# Altium project Stallmaster3000.PrjPcb
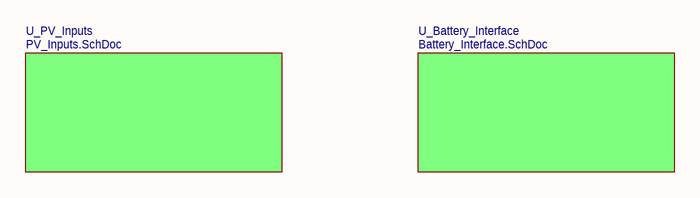
[diagram p0: Overview.SchDoc]
3 sheets, 12 parts. Net scope: global (net labels, ports and power ports of the same name join across sheets).
Sheets:
  Overview.SchDoc
    U_PV_Inputs = PV_Inputs.SchDoc
    U_Battery_Interface = Battery_Interface.SchDoc

## Sheet Overview.SchDoc
size A4; SheetNumber: 1; SheetTotal: 3

### Sub-sheets
U_Battery_Interface = Battery_Interface.SchDoc: no entries
U_PV_Inputs = PV_Inputs.SchDoc: no entries

## Sheet PV_Inputs.SchDoc
size A4; SheetNumber: 2; SheetTotal: 3
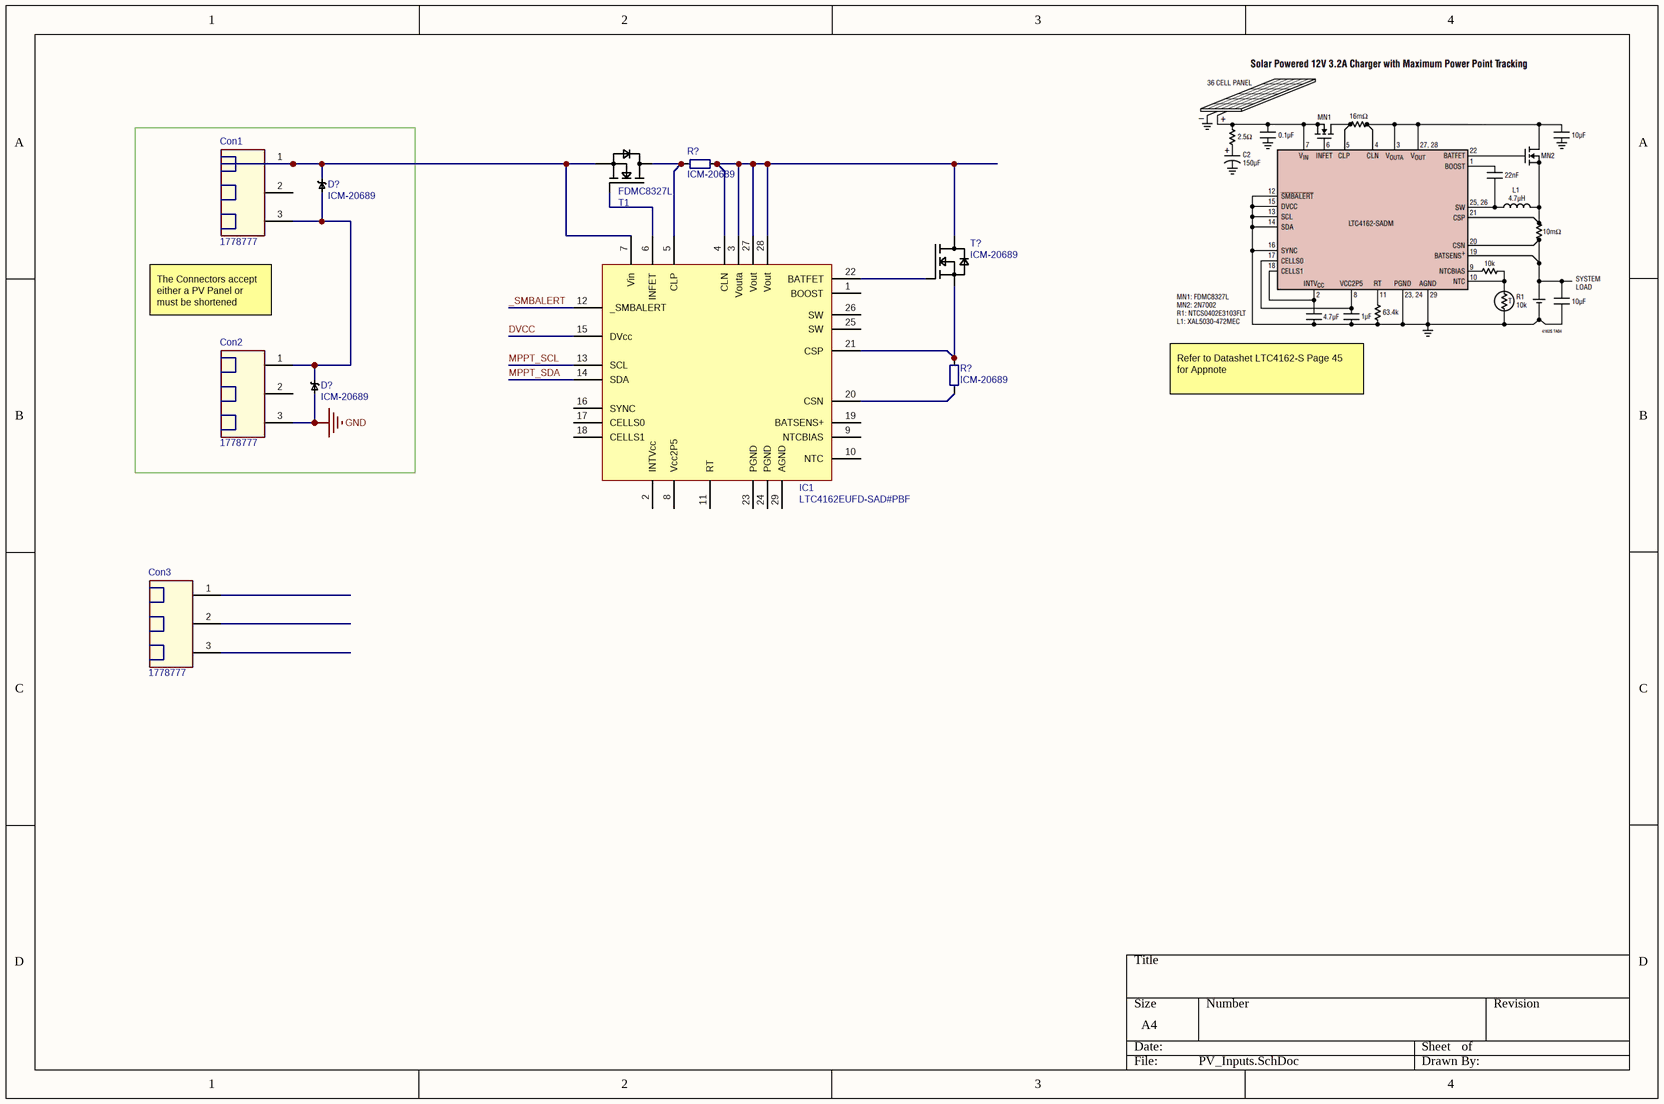
[diagram p1: PV_Inputs.SchDoc]

### Parts
(Parts that share a designator on the sheet are numbered #1, #2 ... from top to bottom, then left to right.)
Con1  1778777  [term_block_1row_3pin_phoenix_smd_2.5mm_90deg_1778777]
Con2  1778777  [term_block_1row_3pin_phoenix_smd_2.5mm_90deg_1778777]
Con3  1778777  [term_block_1row_3pin_phoenix_smd_2.5mm_90deg_1778777]
D?#1  ICM-20689  [DIOM6959X25N]
D?#2  ICM-20689  [DIOM6959X25N]
IC1  LTC4162EUFD-SAD#PBF  [TSQFP50P450X550X80_HS-29N]
R?#1  ICM-20689  [RESC6432X09N]
R?#2  ICM-20689  [RESC1006X04N]
T1  FDMC8327L  [FDMC8327L-D]
T?  ICM-20689  [ic-tdk-qfn-24]

### Nets
GND: Con2.3 D?#2.2(A)
_SMBALERT: IC1.12(_SMBALERT)
DVCC: IC1.15(DVcc)
MPPT_SCL: IC1.13(SCL)
MPPT_SDA: IC1.14(SDA)
NetCon1_1: Con1.1 D?#1.1(K) IC1.7(Vin) T1.1(S)
NetCon1_3: Con1.3 Con2.1 D?#1.2(A) D?#2.1(K)
NetIC1_3: IC1.3(Vouta) IC1.4(CLN) IC1.27(Vout) IC1.28(Vout) R?#1.2 T?.3(D)
NetIC1_5: IC1.5(CLP) R?#1.1 T1.5(D)
NetIC1_6: IC1.6(INFET) T1.4(G)
NetIC1_20: IC1.20(CSN) R?#2.1
NetIC1_21: IC1.21(CSP) R?#2.2 T?.2(S)
NetIC1_22: IC1.22(BATFET) T?.1(G)

Not connected (* = marked no-connect by the designer): Con1 2; Con2 2; Con3 1 2 3; IC1 1(BOOST) 2(INTVcc) 8(Vcc2P5) 9(NTCBIAS) 10(NTC) 11(RT) 16(SYNC) 17(CELLS0) 18(CELLS1) 19(BATSENS+) 23(PGND) 24(PGND) 25(SW) 26(SW) 29(AGND); T1 2(S) 3(S) 6(D) 7(D) 8(D)

### Notes on the sheet
- (near R?#1) Kelvin Connection for Current Sensing
- The Connectors accept either a PV Panel or must be shortened
- Refer to Datashet LTC4162-S Page 45 for Appnote

### Library data of the parts
Con1-Con3 = 1778777: TERM BLOCK HDR 3POS 90DEG 2.5MM; Manufacturer: Phoenix Contact; Manufacturer Standard Lead Time: 4 Weeks; ID: 9; Created_By: PG; Detailed Description: 3 Position Terminal Block Header, Male Pins, Shrouded (4 Side) 0.098" (2.50mm) 90°, Right Angle  Surface Mount; Number of Positions: 3; Material Flammability Rating: UL94 V-0; Voltage - IEC: 160V; Number of Levels: 1; Pitch: 0.098"" (2.50mm); Header Orientation: 90°, Right Angle; Current - IEC: 6A; Part Number: 1778777; Created_Date: 2020-11-12 11:23:48.214956; LifeCycle: yes; Digikey_URL: https://www.digikey.com/en/products/detail/phoenix-contact/1778777/2625550; Manufacturer Part Number: 1778777; ComponentLink1Description: 1778777; ComponentLink1URL: //media.digikey.com/PDF/Data%20Sheets/Phoenix%20Contact%20PDFs/1778777.pdf; Series: COMBICON PTSM; Part Status: Active; Mounting Type: Surface Mount; Insulation Height: 0.197"" (5.00mm); Operating Temperature: -; Ingress Protection: -; Features: Board Guide, Pick and Place Cap, Solder Retention; Contact Material: -; Supplier 1: Digikey; Supplier Part Number 1: 277-2316-2-ND; Supplier: Phoenix Contact; Moisture Sensitivity Level (MSL): 1  (Unlimited); Digi-Key Part Number Cut Tape (CT): 277-2316-1-ND; RoHS Status: RoHS Compliant; Digi-Key Part Number Tape & Reel (TR): 277-2316-2-ND; Digi-Key Part Number Digi-Reel®: 277-2316-6-ND; Termination Style: Solder; Wire Gauge or Range - mm²: -; Wire Gauge or Range - AWG: -; Plug Wire Entry: -; Housing Material: Liquid Crystal Polymer (LCP); Color: Black; Type: Header, Male Pins, Shrouded (4 Side); Screw Size: -; Wire Strip Length: -; Contact Mating Finish: Tin; Contact Tail Length: -; Torque - Screw: -; Positions Per Level: 3
D?#1 D?#2 = SMBJ24A-13-F: SMBJ24A Series 600 W 24 V Surface Mount Uni-Directional TVS Diode - DO-214AA; Manufacturer: TDK InvenSense; Manufacturer Standard Lead Time: 26 Weeks; ID: 2; Created_By: PG; Detailed Description: Accelerometer, Gyroscope, Temperature, 6 Axis Sensor I²C, SPI Output; Sensor Type: Accelerometer, Gyroscope, Temperature, 6 Axis; Output Type: I²C, SPI; Clamping Voltage: 38.9V; Reverse Standoff Voltage: 24V; Min Breakdown Voltage: 26.7V; Peak Pulse Power: 600W; Peak Pulse Current: 15.4A; Direction: Unidirectional; Breakdown Voltage: 30.7V; Max Reverse Leakage Current: 5uA; Test Current: 1mA; Element Configuration: Single; Number of Unidirectional Channels: 1; Power Line Protection: No; Diode Type: ZENER; Created_Date: 2021-09-15 14:31:28.047180; LifeCycle: yes; Digikey_URL: https://www.digikey.com/en/products/detail/tdk-invensense/ICM-20689/5872869; Manufacturer Part Number: ICM-20689; Supplier: TDK InvenSense; ComponentLink1Description: Datasheet; ComponentLink1URL: https://invensense.tdk.com/wp-content/uploads/2016/03/PB-000045-ICM-20689-v1.0.pdf?ref_disty=digikey; Series: -; Part Status: Active; Operating Temperature: -40°C ~ 85°C (TA); Mounting Type: Surface Mount; RoHS Status: ROHS3 Compliant; Moisture Sensitivity Level (MSL): 3  (168 Hours); HTSUS: 8542.39.0001; Part Number: ICM-20689; Supplier 1: Digikey; Supplier Part Number 1: 1428-1059-2-ND; Digi-Key Part Number Cut Tape (CT): 1428-1059-1-ND; ECCN: 7A994; Digi-Key Part Number Tape & Reel (TR): 1428-1059-2-ND; Digi-Key Part Number Digi-Reel: 1428-1059-6-ND; Supplier 2: Mouser; Supplier Part Number 2: 621-SMBJ24A-13-F; RoHS: Yes; Category: TVS Diodes; Mount: Surface Mount; Case/Package: SMB; Number of Pins: 2; Min Operating Temperature: -55°C; Max Operating Temperature: 150°C; Packaging: Tape and Reel; Polarity: Unidirectional; Package Quantity: 3000; Max Surge Current: 15.4A; Max Breakdown Voltage: 30.7V; Reverse Breakdown Voltage: 26.7V; Termination: SMD/SMT; Number of Elements: 1; Leakage Current: 5uA; Voltage Rating (DC): 24V; Max Power Dissipation: 600W; Resistor Type: Zener; Power Dissipation: 600W; Clamping Voltage-Max: 38.9V; Working Voltage: 24V; Length: 4.57mm; Width: 3.9mm; Height: 2.62mm; Radiation Hardening: No; RoHS Compliant: Yes; Lead Free: Lead Free; ComponentLink2URL: https://datasheet.ciiva.com/15143/getdatasheetpartid-93534-15143418.pdf?src-supplier=Verical; ComponentLink2Description: https://datasheet.ciiva.com/15143/getdatasheetpartid-93534-15143418.pdf?src-supplier=Verical; ComponentLink3URL: https://datasheet.ciiva.com/16211/ds19002-16211001.pdf?src-supplier=Future+Electronics; ComponentLink3Description: https://datasheet.ciiva.com/16211/ds19002-16211001.pdf?src-supplier=Future+Electronics; ComponentLink4URL: https://datasheet.ciiva.com/17412/ds19002-17412445.pdf?src-supplier=Avnet+Europe; ComponentLink4Description: https://datasheet.ciiva.com/17412/ds19002-17412445.pdf?src-supplier=Avnet+Europe
IC1 = LTC4162EUFD-SAD#PBF: Switching Battery Charger Lead-Acid/Li-Ion/Li-FePO4 3200mA 35V 28-Pin QFN EP Tube; Manufacturer: Analog Devices; Supplier 1: Arrow Electronics; Manufacturer Part Number: LTC4162EUFD-SAD#PBF; RoHS: Yes; Category: Battery Management; Stock 1: 36; RoHS Compliant: Yes; Supplier Part Number 1: LTC4162EUFD-SAD#PBF
R?#1 = CSM2512FT15L0: RES SHUNT, 2512, 0.015 ohm, 1%, 3W; Manufacturer: TDK InvenSense; Manufacturer Standard Lead Time: 26 Weeks; ID: 2; Created_By: PG; Detailed Description: Accelerometer, Gyroscope, Temperature, 6 Axis Sensor I²C, SPI Output; Sensor Type: Accelerometer, Gyroscope, Temperature, 6 Axis; Output Type: I²C, SPI; Created_Date: 2021-09-15 14:31:28.047180; LifeCycle: yes; Digikey_URL: https://www.digikey.com/en/products/detail/tdk-invensense/ICM-20689/5872869; Manufacturer Part Number: ICM-20689; Supplier: TDK InvenSense; ComponentLink1Description: Datasheet; ComponentLink1URL: https://invensense.tdk.com/wp-content/uploads/2016/03/PB-000045-ICM-20689-v1.0.pdf?ref_disty=digikey; Series: -; Part Status: Active; Operating Temperature: -40°C ~ 85°C (TA); Mounting Type: Surface Mount; RoHS Status: ROHS3 Compliant; Moisture Sensitivity Level (MSL): 3  (168 Hours); HTSUS: 8542.39.0001; Part Number: ICM-20689; Supplier 1: Digikey; Supplier Part Number 1: 1428-1059-2-ND; Digi-Key Part Number Cut Tape (CT): 1428-1059-1-ND; ECCN: 7A994; Digi-Key Part Number Tape & Reel (TR): 1428-1059-2-ND; Digi-Key Part Number Digi-Reel: 1428-1059-6-ND; Supplier 2: Digi-Key; Supplier Part Number 2: 738-CSM2512FT15L0CT-ND; RoHS: Yes; Category: Chip SMD Resistors
R?#2 = CSS0402FT10L0: Res Metal Alloy 0402 0.01 Ohm 1% 0.33W(1/3W) ±100ppm/C Pad SMD Automotive T/R; Manufacturer: TDK InvenSense; Manufacturer Standard Lead Time: 26 Weeks; ID: 2; Created_By: DU; Detailed Description: Accelerometer, Gyroscope, Temperature, 6 Axis Sensor I²C, SPI Output; Sensor Type: Accelerometer, Gyroscope, Temperature, 6 Axis; Output Type: I²C, SPI; LifeCycle: yes; Digikey_URL: https://www.digikey.com/en/products/detail/tdk-invensense/ICM-20689/5872869; Manufacturer Part Number: ICM-20689; Supplier: TDK InvenSense; ComponentLink1Description: Datasheet; ComponentLink1URL: https://invensense.tdk.com/wp-content/uploads/2016/03/PB-000045-ICM-20689-v1.0.pdf?ref_disty=digikey; Series: -; Part Status: Active; Operating Temperature: -40°C ~ 85°C (TA); Mounting Type: Surface Mount; RoHS Status: ROHS3 Compliant; Moisture Sensitivity Level (MSL): 3  (168 Hours); HTSUS: 8542.39.0001; Part Number: ICM-20689; Supplier 1: Digikey; Supplier Part Number 1: 1428-1059-2-ND; Digi-Key Part Number Cut Tape (CT): 1428-1059-1-ND; ECCN: 7A994; Digi-Key Part Number Tape & Reel (TR): 1428-1059-2-ND; Digi-Key Part Number Digi-Reel: 1428-1059-6-ND; Supplier 2: Digi-Key; Supplier Part Number 2: 738-CSS0402FT10L0CT-ND; RoHS: Yes; Category: Chip SMD Resistors
T1 = FDMC8327L: MOSFET, N-CH, 40V, 8MLP; Transistor Polarity: N Channel; Continuous Drain Current; Manufacturer: ON Semiconductor / Fairchild; Rds On Max: 9.7mR; Input Capacitance: 1.85nF; Rise Time: 2.2ns; Continuous Drain Current (ID): 14A; Max Power Dissipation: 30W; Gate to Source Voltage (Vgs): 20V; Number of Elements: 1; Turn-On Delay Time: 8.4ns; Turn-Off Delay Time: 20ns; Threshold Voltage: 1.7V; Element Configuration: Single; Polarity: N-CHANNEL; Supplier 1: RSComponents; Manufacturer Part Number: FDMC8327L; RoHS: Yes; Category: MOSFETs; Stock 1: 130; Pricing 1: 5=1,28400, 10=1,06100, 100=0,75000, 500=0,67200, 1000=0,55800, 5=0,92400, 10=0,76400, 100=0,54000, 500=0,48400, 1000=0,40200 (USD); Mount: Surface Mount; Number of Pins: 8; Weight: 0.18g; Min Operating Temperature: -55°C; Max Operating Temperature: 150°C; Package Quantity: 1; Packaging: Tape and Reel; Drain to Source Voltage (Vdss): 40V; Drain to Source Breakdown Voltage: 40V; Drain to Source Resistance: 9.7mR; Power Dissipation: 30W; Fall Time: 2.2ns; Series: PowerTrench®; Length: 3.3mm; Width: 3.3mm; Height: 0.75mm; Radiation Hardening: No; REACH SVHC: No SVHC; RoHS Compliant: Yes; ComponentLink1URL: https://datasheet.ciiva.com/13060/fdmc8327l-103580-13060051.pdf?src-supplier=Mouser; ComponentLink1Description: https://datasheet.ciiva.com/13060/fdmc8327l-103580-13060051.pdf?src-supplier=Mouser; ComponentLink2URL: https://datasheet.ciiva.com/29752/fdmc8327l-29752225.pdf?src-supplier=Digi-Key; ComponentLink2Description: https://datasheet.ciiva.com/29752/fdmc8327l-29752225.pdf?src-supplier=Digi-Key; ComponentLink3URL: https://datasheet.ciiva.com/7967/1774752-7967973.pdf?src-supplier=Element14; ComponentLink3Description: https://datasheet.ciiva.com/7967/1774752-7967973.pdf?src-supplier=Element14; ComponentLink4URL: https://datasheet.ciiva.com/29752/fdmc8327l-29752230.pdf?src-supplier=Digi-Key; ComponentLink4Description: https://datasheet.ciiva.com/29752/fdmc8327l-29752230.pdf?src-supplier=Digi-Key; ComponentLink5URL: https://datasheet.ciiva.com/11175/fdmc8327l-11175500.pdf?src-supplier=Avnet; ComponentLink5Description: https://datasheet.ciiva.com/11175/fdmc8327l-11175500.pdf?src-supplier=Avnet; ComponentLink6URL: https://datasheet.ciiva.com/29752/fdmc8327l-29752220.pdf?src-supplier=Digi-Key; ComponentLink6Description: https://datasheet.ciiva.com/29752/fdmc8327l-29752220.pdf?src-supplier=Digi-Key; Supplier Part Number 1: 8648203
T? = 2N7002-T1-E3: Trans Mosfet N-ch 60V 0.115A 3-PIN SOT-23 T/r / Mosfet N-ch 60V 115MA SOT23; Manufacturer: TDK InvenSense; Manufacturer Standard Lead Time: 26 Weeks; ID: 2; Created_By: PG; Detailed Description: Accelerometer, Gyroscope, Temperature, 6 Axis Sensor I²C, SPI Output; Sensor Type: Accelerometer, Gyroscope, Temperature, 6 Axis; Output Type: I²C, SPI; Input Capacitance: 50pF; Number of Elements: 1; Max Power Dissipation: 200mW; Nominal Vgs: 2.1V; Rds On Max: 7.5R; Gate to Source Voltage (Vgs): 20V; Element Configuration: Single; Polarity: N-CHANNEL; Created_Date: 2021-09-15 14:31:28.047180; LifeCycle: yes; Digikey_URL: https://www.digikey.com/en/products/detail/tdk-invensense/ICM-20689/5872869; Manufacturer Part Number: ICM-20689; Supplier: TDK InvenSense; ComponentLink1Description: Datasheet; ComponentLink1URL: https://invensense.tdk.com/wp-content/uploads/2016/03/PB-000045-ICM-20689-v1.0.pdf?ref_disty=digikey; Series: -; Part Status: Active; Operating Temperature: -40°C ~ 85°C (TA); Mounting Type: Surface Mount; RoHS Status: ROHS3 Compliant; Moisture Sensitivity Level (MSL): 3  (168 Hours); HTSUS: 8542.39.0001; Part Number: ICM-20689; Supplier 1: Digikey; Supplier Part Number 1: 1428-1059-2-ND; Digi-Key Part Number Cut Tape (CT): 1428-1059-1-ND; ECCN: 7A994; Digi-Key Part Number Tape & Reel (TR): 1428-1059-2-ND; Digi-Key Part Number Digi-Reel: 1428-1059-6-ND; Supplier 2: Mouser; Supplier Part Number 2: 781-2N7002-T1-E3; RoHS: Yes; Category: MOSFETs; Mount: Surface Mount; Case/Package: TO-236; Number of Pins: 3; Weight: 0.050717oz; Contact Plating: Tin,Matte; Min Operating Temperature: -55°C; Max Operating Temperature: 150°C; Packaging: Tape and Reel; Package Quantity: 3000; Drain to Source Voltage (Vdss): 60V; Continuous Drain Current (ID): 115mA; Drain to Source Breakdown Voltage: 60V; Drain to Source Resistance: 7.5R; Power Dissipation: 200mW; Threshold Voltage: 2.1V; Number of Channels: 1; Voltage: 60V; On-State Resistance: 7.5R; Drain-source On Resistance-Max: 7.5R; Length: 3.04mm; Width: 1.4mm; Height: 1.02mm; Radiation Hardening: No; REACH SVHC: Unknown; Lead Free: Lead Free; RoHS Compliant: Yes; ComponentLink2URL: https://datasheet.ciiva.com/15137/getdatasheetpartid-93546-15137770.pdf?src-supplier=Verical; ComponentLink2Description: https://datasheet.ciiva.com/15137/getdatasheetpartid-93546-15137770.pdf?src-supplier=Verical; ComponentLink3URL: https://datasheet.ciiva.com/16465/70226-16465589.pdf?src-supplier=Avnet+Asia; ComponentLink3Description: https://datasheet.ciiva.com/16465/70226-16465589.pdf?src-supplier=Avnet+Asia; ComponentLink4URL: https://datasheet.ciiva.com/46382/707252-46382293.pdf?src-supplier=Element14; ComponentLink4Description: https://datasheet.ciiva.com/46382/707252-46382293.pdf?src-supplier=Element14; ComponentLink5URL: https://datasheet.ciiva.com/8084/70226-8084200.pdf?src-supplier=Avnet; ComponentLink5Description: https://datasheet.ciiva.com/8084/70226-8084200.pdf?src-supplier=Avnet; ComponentLink6URL: https://datasheet.ciiva.com/1188/707252-1188409.pdf?src-supplier=Element14; ComponentLink6Description: https://datasheet.ciiva.com/1188/707252-1188409.pdf?src-supplier=Element14; ComponentLink7URL: https://datasheet.ciiva.com/4442/70226-240087-4442394.pdf?src-supplier=Mouser; ComponentLink7Description: https://datasheet.ciiva.com/4442/70226-240087-4442394.pdf?src-supplier=Mouser; ComponentLink8URL: https://datasheet.ciiva.com/15043/70226-15043562.pdf?src-supplier=Digi-Key; ComponentLink8Description: https://datasheet.ciiva.com/15043/70226-15043562.pdf?src-supplier=Digi-Key; ComponentLink9URL: https://datasheet.ciiva.com/15043/70226-15043563.pdf?src-supplier=Digi-Key; ComponentLink9Description: https://datasheet.ciiva.com/15043/70226-15043563.pdf?src-supplier=Digi-Key; ComponentLink10URL: https://datasheet.ciiva.com/15043/70226-15043564.pdf?src-supplier=Digi-Key; ComponentLink10Description: https://datasheet.ciiva.com/15043/70226-15043564.pdf?src-supplier=Digi-Key; ComponentLink11URL: https://datasheet.ciiva.com/26216/70226-26216204.pdf?src-supplier=Avnet+Europe; ComponentLink11Description: https://datasheet.ciiva.com/26216/70226-26216204.pdf?src-supplier=Avnet+Europe

## Sheet Battery_Interface.SchDoc
size A4; SheetNumber: 3; SheetTotal: 3
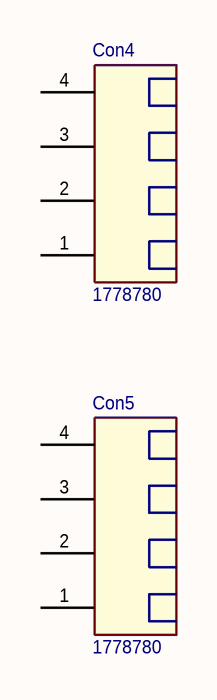
[diagram p2: Battery_Interface.SchDoc]

### Parts
Con4  1778780  [term_block_1row_4pin_phoenix_smd_2.5mm_90deg_1778780]
Con5  1778780  [term_block_1row_4pin_phoenix_smd_2.5mm_90deg_1778780]

### Nets

Not connected (* = marked no-connect by the designer): Con4 1 2 3 4; Con5 1 2 3 4

### Library data of the parts
Con4 Con5 = 1778780: TERM BLOCK HDR 4POS 90DEG 2.5MM; Manufacturer: Phoenix Contact; Manufacturer Standard Lead Time: 4 Weeks; ID: 7; Created_By: PG; Detailed Description: 4 Position Terminal Block Header, Male Pins, Shrouded (4 Side) 0.098" (2.50mm) 90°, Right Angle - Surface Mount; Number of Positions: 4; Material Flammability Rating: UL94 V-0; Voltage - IEC: 160 V; Number of Levels: 1; Pitch: 0.098" (2.50mm); Header Orientation: 90°, Right Angle; Current - IEC: 6A; Part Number: 1778780; Created_Date: 2020-10-30 15:08:21.525401; LifeCycle: yes; Digikey_URL: https://www.digikey.com/en/products/detail/phoenix-contact/1778780/2625551; Manufacturer Part Number: 1778780; ComponentLink1Description: 1778780; ComponentLink1URL: //media.digikey.com/PDF/Data%20Sheets/Phoenix%20Contact%20PDFs/1778780.pdf; Series: COMBICON PTSM; Part Status: Active; Mounting Type: Surface Mount; Insulation Height: 0.197" (5.00mm); Operating Temperature: -; Ingress Protection: -; Features: Board Guide, Pick and Place Cap, Solder Retention; Contact Material: -; Supplier 1: Digikey; Supplier Part Number 1: 277-2317-2-ND; Supplier: Phoenix Contact; Moisture Sensitivity Level (MSL): 1  (Unlimited); Digi-Key Part Number Cut Tape (CT): 277-2317-1-ND; RoHS Status: RoHS Compliant; Digi-Key Part Number Tape & Reel (TR): 277-2317-2-ND; Digi-Key Part Number Digi-Reel®: 277-2317-6-ND; Termination Style: Solder; Wire Gauge or Range - mm²: -; Wire Gauge or Range - AWG: -; Plug Wire Entry: -; Housing Material: Liquid Crystal Polymer (LCP); Color: Black; Type: Header, Male Pins, Shrouded (4 Side); Screw Size: -; Wire Strip Length: -; Contact Mating Finish: Tin; Contact Tail Length: -; Torque - Screw: -; Positions Per Level: 4